# Altium schematic sheet ProtectedLDO.SchDoc
size A4; SheetNumber: 15; SheetTotal: 15
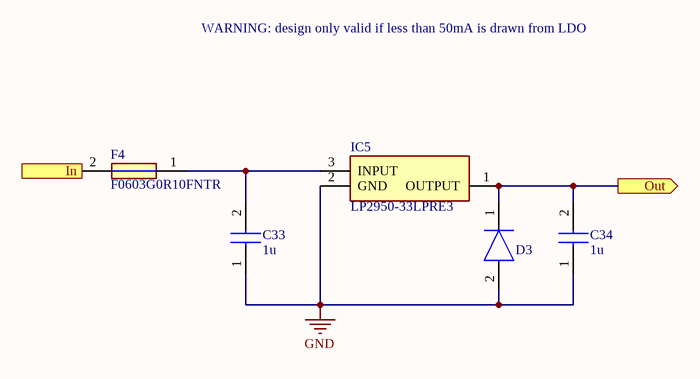
[diagram p0: ProtectedLDO.SchDoc]

## Parts
C33  value 1u  [CAPC1608X90N]  (hidden comment: C0603C105K9PACTU)
C34  value 1u  [CAPC1608X90N]  (hidden comment: C0603C105K9PACTU)
D3  BZY55B3V3_RBG  [BZY55B3V3RBG]  (value not drawn)
F4  F0603G0R10FNTR  [F0603G0R10FNTR]
IC5  LP2950-33LPRE3  [TL431CLP]

## Ports
In (in), Out (out)

## Nets
GND: C33.1 C34.1 D3.2(A) IC5.2(GND)
In: F4.2 ; port In
Out: C34.2 D3.1(K) IC5.1(OUTPUT) ; port Out
NetC33_2: C33.2 F4.1 IC5.3(INPUT)

## Notes on the sheet
- WARNING: design only valid if less than 50mA is drawn from LDO

## Library data of the parts
C33 C34 = C0603C105K9PACTU: Capacitor; Manufacturer_Name: Kemet; Datasheet Link: https://api.kemet.com/component-edge/download/specsheet/C0603C105K9PACTU.pdf; Height: 0.9mm; Manufacturer_Part_Number: C0603C105K9PACTU; Mouser Part Number: 80-C0603C105K9P; Mouser Price/Stock: https://www.mouser.co.uk/ProductDetail/KEMET/C0603C105K9PACTU?qs=WeB8qxTbSWYfpKUes7RYxA%3D%3D; Arrow Part Number: C0603C105K9PACTU; Arrow Price/Stock: https://www.arrow.com/en/products/c0603c105k9pactu/kemet-corporation?region=nac
D3 = BZY55B3V3_RBG: Diode; Manufacturer_Name: Taiwan Semiconductor; Manufacturer_Part_Number: BZY55B3V3 RBG; Datasheet Link: https://componentsearchengine.com/Datasheets/1/BZY55B3V3 RBG.pdf; Height: 0.85mm; Mouser Part Number: 821-BZY55B3V3RBG; Mouser Price/Stock: https://www.mouser.co.uk/ProductDetail/Taiwan-Semiconductor/BZY55B3V3-RBG?qs=mAH9sUMRCtvrJdI%2FtfeTug%3D%3D; Supplier 1: Mouser; Supplier Part Number 1: 821-BZY55B3V3RBG
F4 = F0603G0R10FNTR: Fuse; Manufacturer_Name: AVX; Datasheet Link: https://datasheet.datasheetarchive.com/originals/distributors/Datasheets-DGA13/1256919.pdf; Height: 0.71mm; Manufacturer_Part_Number: F0603G0R10FNTR; Mouser Part Number: 581-F0603G0R10FNTR; Mouser Price/Stock: https://www.mouser.co.uk/ProductDetail/AVX/F0603G0R10FNTR?qs=JtEK8acvKONFc%2FnvQ8Va1w%3D%3D; Arrow Part Number: F0603G0R10FNTR; Arrow Price/Stock: https://www.arrow.com/en/products/f0603g0r10fntr/avx; Supplier 1: Mouser; Supplier Part Number 1: 581-F0603G0R10FNTR
IC5 = LP2950-33LPRE3: Integrated Circuit; Manufacturer_Name: Texas Instruments; Datasheet Link: http://www.ti.com/lit/gpn/lp2950; Height: 9.34mm; Manufacturer_Part_Number: LP2950-33LPRE3; Mouser Part Number: 595-LP2950-33LPRE3; Mouser Price/Stock: https://www.mouser.co.uk/ProductDetail/Texas-Instruments/LP2950-33LPRE3?qs=iSMark9AYDUagDsOL8Eqdw%3D%3D; Arrow Part Number: LP2950-33LPRE3; Arrow Price/Stock: https://www.arrow.com/en/products/lp2950-33lpre3/texas-instruments?region=nac; Supplier 1: Mouser; Supplier Part Number 1: 595-LP2950-33LPRE3